# EAGLE design transition_control_arduino (EAGLE 9.2.2)
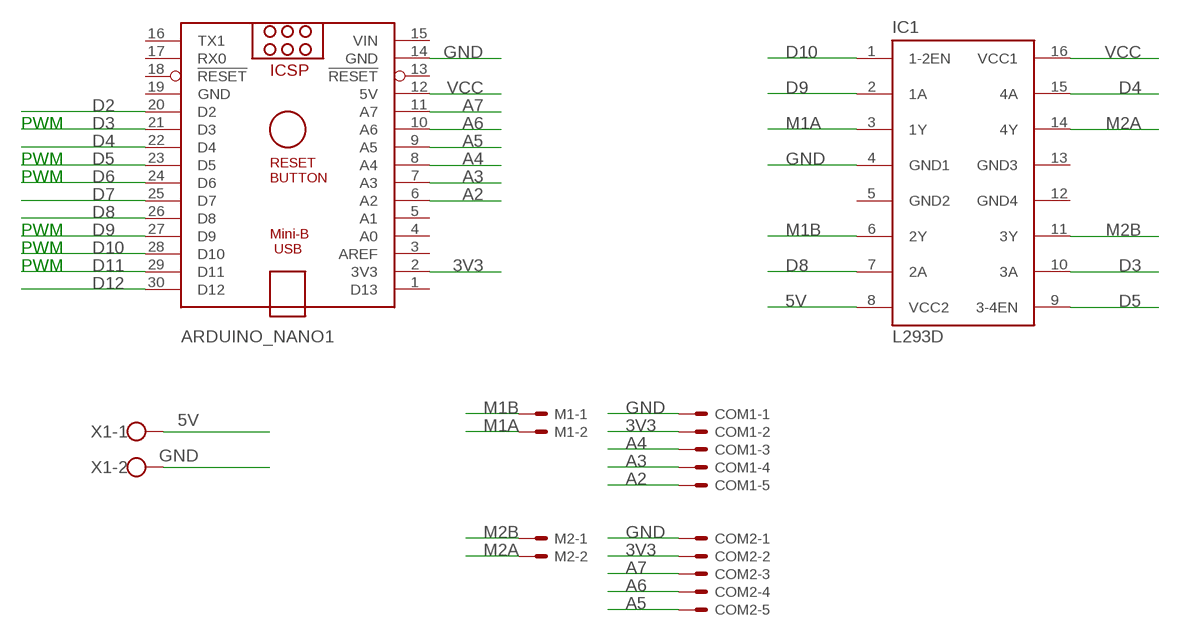
[diagram p0: schematic, sheet 1]

## Parts
ARDUINO_NANO1  ARDUINO_NANO  [ARDUINO_NANO]
COM1  JST-XH-05-PIN-ROUND-PAD  [JST-XH-05-PACKAGE-ROUND-PAD]
COM2  JST-XH-05-PIN-ROUND-PAD  [JST-XH-05-PACKAGE-ROUND-PAD]
IC1  L293D  [DIL16]
M1  JST-XH-02-PIN-ROUND-PAD  [JST-XH-02-PACKAGE-ROUND-PAD]
M2  JST-XH-02-PIN-ROUND-PAD  [JST-XH-02-PACKAGE-ROUND-PAD]
X1  W237-102  [W237-102]

## Nets
3V3 [Thicc]: ARDUINO_NANO1.2(3V3) COM1.2 COM2.2
5V [Thicc]: IC1.8(VCC2) X1.1
A2 [Thicc]: ARDUINO_NANO1.6(A2) COM1.5
A3 [Thicc]: ARDUINO_NANO1.7(A3) COM1.4
A4 [Thicc]: ARDUINO_NANO1.8(A4) COM1.3
A5 [Thicc]: ARDUINO_NANO1.9(A5) COM2.5
A6 [Thicc]: ARDUINO_NANO1.10(A6) COM2.4
A7 [Thicc]: ARDUINO_NANO1.11(A7) COM2.3
D2 [Thicc]: ARDUINO_NANO1.20(D2)
D3 [Thicc]: ARDUINO_NANO1.21(D3) IC1.10(3A)
D4 [Thicc]: ARDUINO_NANO1.22(D4) IC1.15(4A)
D5 [Thicc]: ARDUINO_NANO1.23(D5) IC1.9(3-4EN)
D6 [Thicc]: ARDUINO_NANO1.24(D6)
D7 [Thicc]: ARDUINO_NANO1.25(D7)
D8 [Thicc]: ARDUINO_NANO1.26(D8) IC1.7(2A)
D9 [Thicc]: ARDUINO_NANO1.27(D9) IC1.2(1A)
D10 [Thicc]: ARDUINO_NANO1.28(D10) IC1.1(1-2EN)
D11 [Thicc]: ARDUINO_NANO1.29(D11)
D12 [Thicc]: ARDUINO_NANO1.30(D12)
GND [Thicc]: ARDUINO_NANO1.14(GND) COM1.1 COM2.1 IC1.4(GND1) X1.2
M1A [Thicc]: IC1.3(1Y) M1.2
M1B [Thicc]: IC1.6(2Y) M1.1
M2A [Thicc]: IC1.14(4Y) M2.2
M2B [Thicc]: IC1.11(3Y) M2.1
VCC [Thicc]: ARDUINO_NANO1.12(5V) IC1.16(VCC1)
Unconnected: ARDUINO_NANO1.1(D13) ARDUINO_NANO1.3(AREF) ARDUINO_NANO1.4(A0) ARDUINO_NANO1.5(A1) ARDUINO_NANO1.13(!RESET) ARDUINO_NANO1.16(TX1) ARDUINO_NANO1.17(RX0) ARDUINO_NANO1.18(!RESET)

## Notes on the sheet
- PWM
- PWM
- PWM
- PWM
- PWM
- PWM

## Power pins joined to a net without a drawn wire
GND: ARDUINO_NANO1.19(GND)
GND2: IC1.5(GND2)
GND3: IC1.13(GND3)
GND4: IC1.12(GND4)
VIN: ARDUINO_NANO1.15(VIN)

## Library data of the parts
ARDUINO_NANO1 = ArduinoNanoV30:ARDUINO_NANO: Arduino Nano V3.0 Overview: The Arduino Nano is a small, complete, and breadboard-friendly board based on the ATmega328 (Arduino Nano 3.x) or ATmega168 (Arduino Nano 2.x). It has more or less the same functionality of the Arduino Duemilanove, but in a different package. It lacks only a DC power jack, and works with a Mini-B USB cable instead of a standard one. The Nano was designed and is being produced by Gravitech. Specifications: Microcontroller Atmel ATmega168 or ATmega328 Operating Voltage (logic level) 5 V Input Voltage (recommended) 7-12 V Input Voltage (limits) 6-20 V Digital I/O Pins 14 (of which 6 provide PWM output) Analog Input Pins 8 DC Current per I/O Pin 40 mA Flash Memory 16 KB (ATmega168) or 32 KB (ATmega328) of which 2 KB used by bootloader SRAM 1 KB (ATmega168) or 2 KB (ATmega328) EEPROM 512 bytes (ATmega168) or 1 KB (ATmega328) Clock Speed 16 MHz Dimensions 0.73" x 1.70" Length 45 mm Width 18 mm Weigth 5 g Power: The Arduino Nano can be powered via the Mini-B USB connection, 6-20V unregulated external power supply (pin 30), or 5V regulated external power supply (pin 27). The power source is automatically selected to the highest voltage source. Memory: The ATmega168 has 16 KB of flash memory for storing code (of which 2 KB is used for the bootloader); the ATmega328 has 32 KB, (also with 2 KB used for the bootloader). The ATmega168 has 1 KB of SRAM and 512 bytes of EEPROM (which can be read and written with the EEPROM library); the ATmega328 has 2 KB of SRAM and 1 KB of EEPROM. Input and Output: Each of the 14 digital pins on the Nano can be used as an input or output, using pinMode(), digitalWrite(), and digitalRead() functions. They operate at 5 volts. Each pin can provide or receive a maximum of 40 mA and has an internal pull-up resistor (disconnected by default) of 20-50 kOhms. In addition, some pins have specialized functions. Visit Arduino - ArduinoBoardNano <https://www.arduino.cc/en/Main/ArduinoBoardNano>
COM1 COM2 = Rembrandt Electronics - JST XH Connectors v1-0:JST-XH-05-PIN: JST XH Connector 2 Pin Wire to board connector. Pitch: 2,54 mm, (0.100") Number of pins: 5 Created by Rembrandt Electronics www.rembrandtelectronics.com
IC1 = st-microelectronics:L293D: PUSH-PULL 4 CHANNEL DRIVER; MPN: L293D; OC_FARNELL: 9589619; OC_NEWARK: 56P8249
M1 M2 = Rembrandt Electronics - JST XH Connectors v1-0:JST-XH-02-PIN: JST XH Connector 2 Pin Wire to board connector. Pitch: 2,54 mm, (0.100") Number of pins: 2 Created by Rembrandt Electronics www.rembrandtelectronics.com
X1 = con-wago-500:W237-102: WAGO SCREW CLAMP; MPN: 237-102; OC_FARNELL: unknown; OC_NEWARK: 70K9898

## Net classes
1 Thicc: width 0.813 mm

## Board
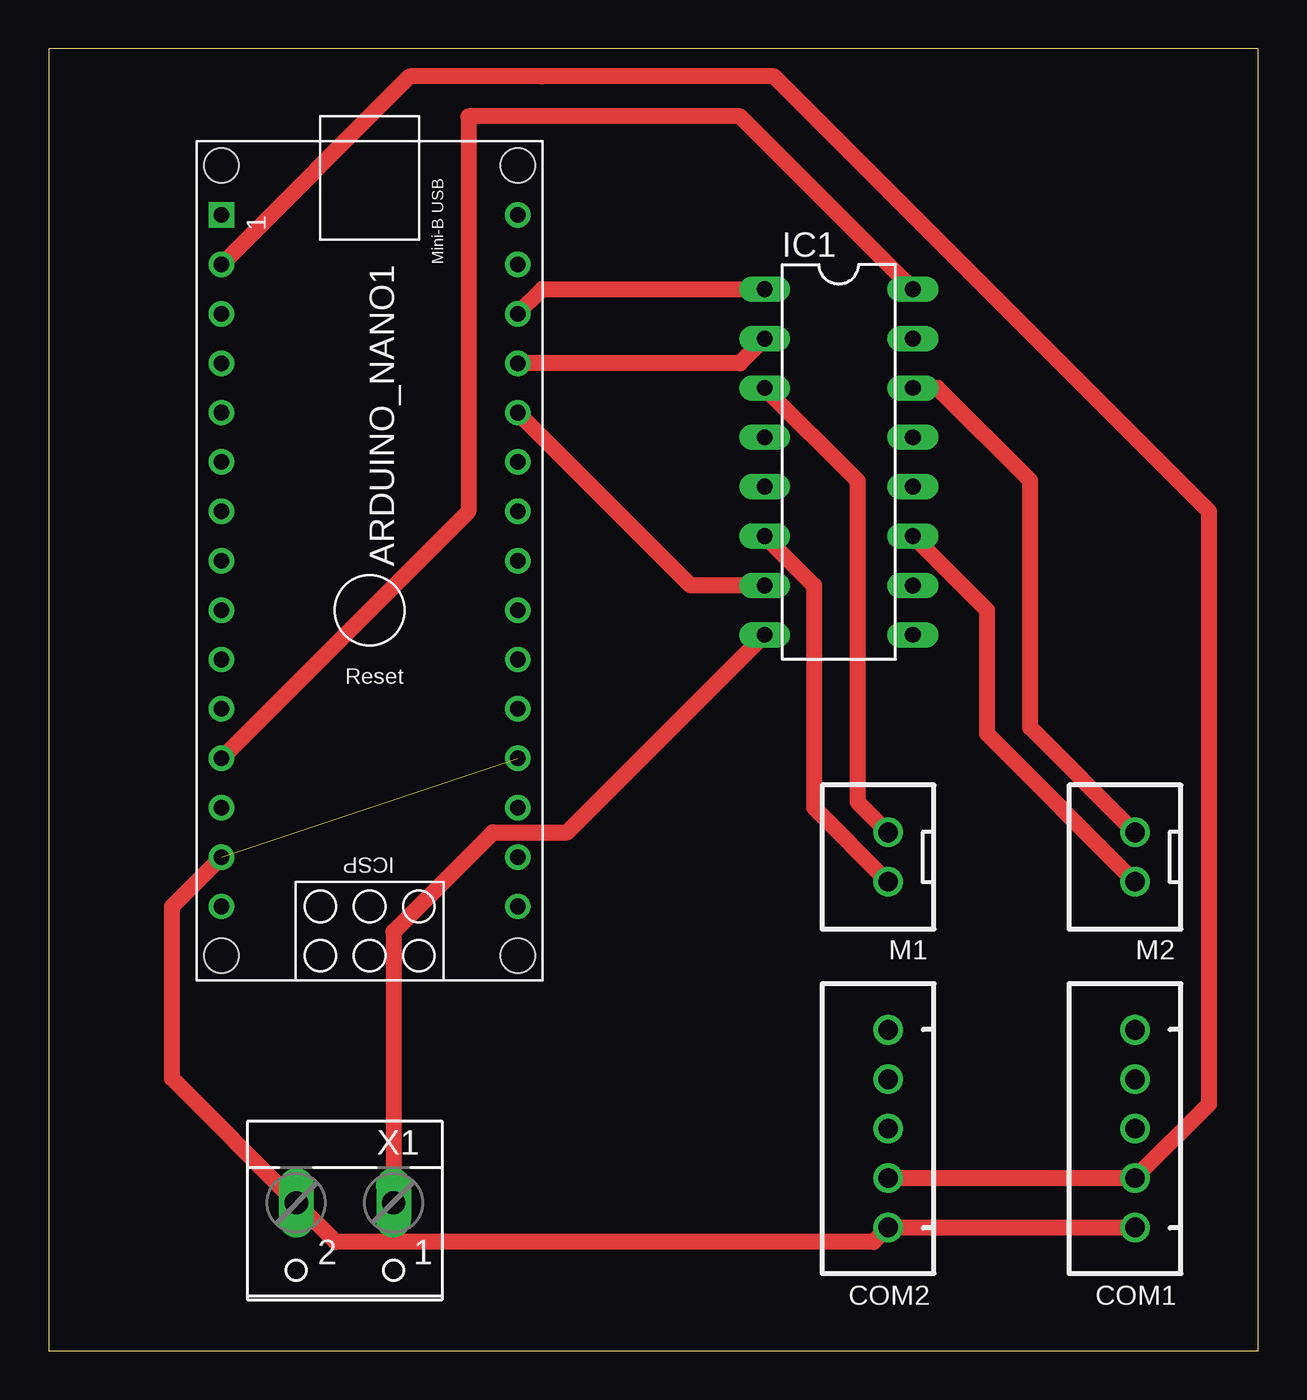
[diagram p1: board, top side]
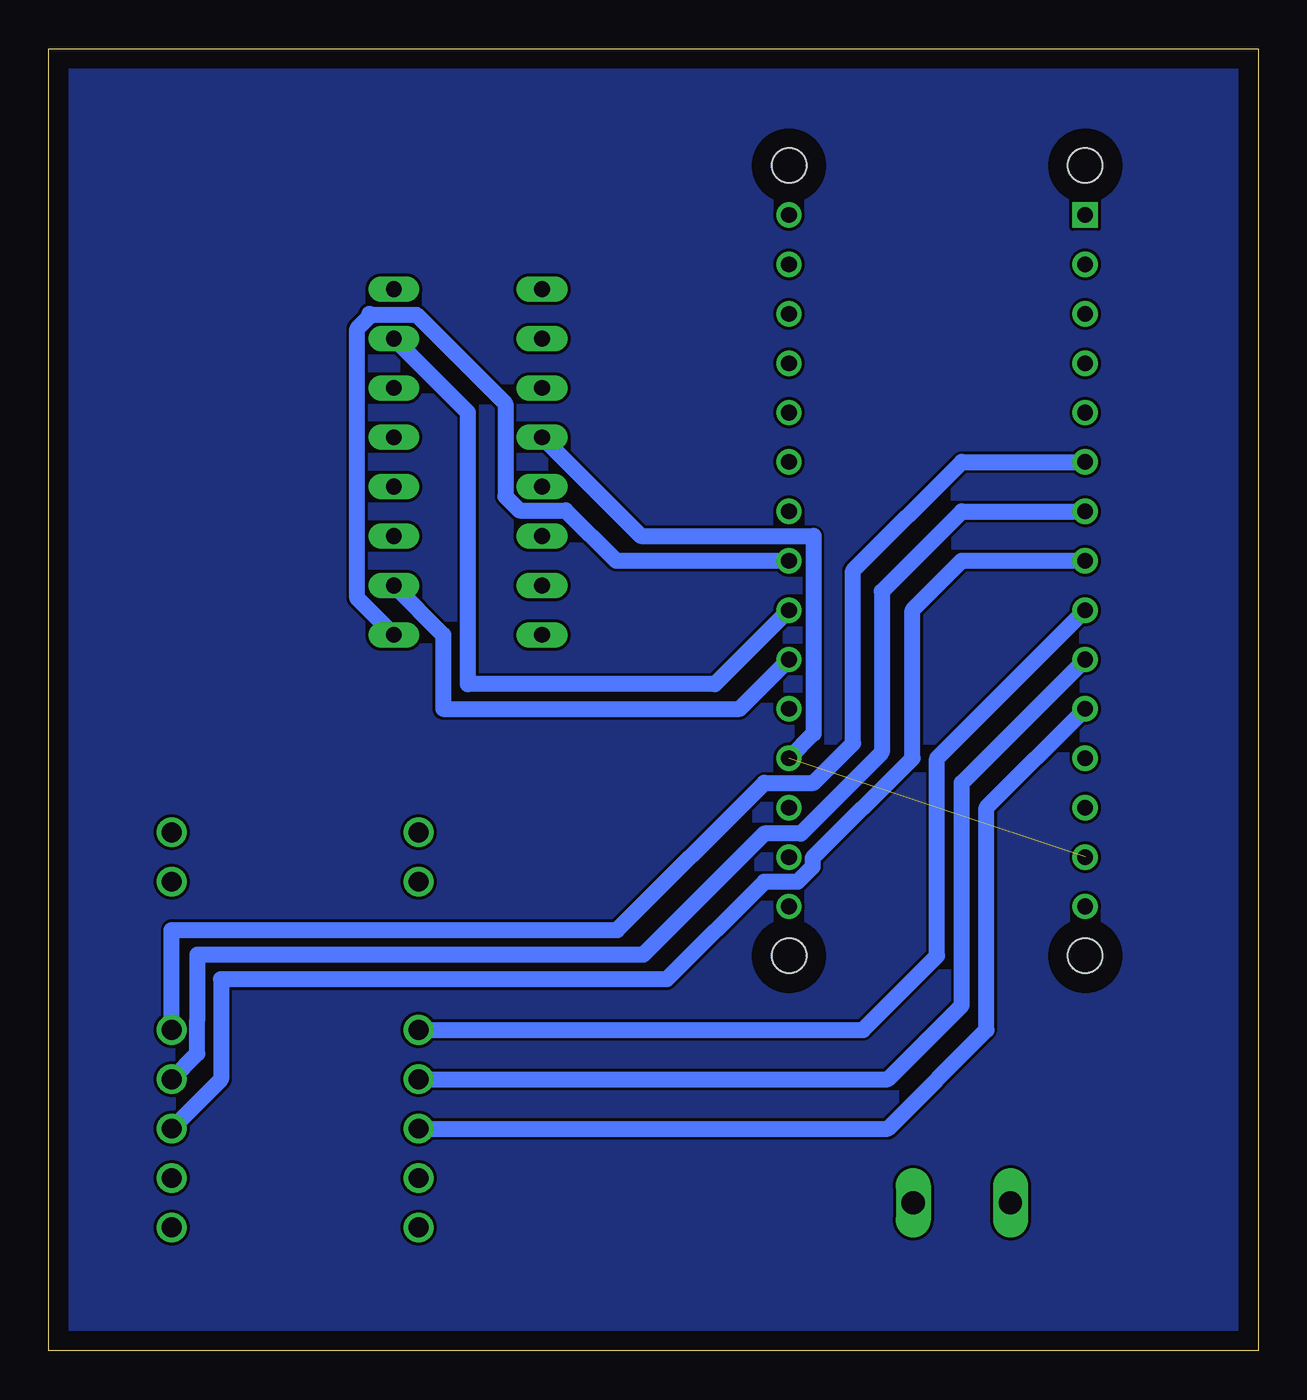
[diagram p2: board, bottom side, seen from below]

Size 62.21 x 66.98 mm. Coordinates in mm from the lower left corner, seen from the top.
Outline: 0,0 62.21,0 62.21,66.98 0,66.98 0,0
Copper layers (1*16): Top 0.035mm / dielectric 1.5mm / Bottom 0.035mm
Design rules "default": minimum track width 6mil, minimum drill 0.35mm, track to track 6mil, track to pad 6mil, pad to pad 6mil, via to via 6mil, smd to smd 6mil, copper to edge 40mil, drill to drill 6mil, minimum pad ring 10mil, minimum via ring 8mil, stop-mask expansion 4mil, vias tented up to drill 0mil, thermal gap 10mil

### Footprints (pad centres in the part's own frame; a part is rotated, then mirrored left to right if it is on the bottom)
ARDUINO_NANO = drill 0.8 square: 1 -20.32,-7.62 | drill 0.8: 2 -17.78,-7.62; 3 -15.24,-7.62; 4 -12.7,-7.62; 5 -10.16,-7.62; 6 -7.62,-7.62; 7 -5.08,-7.62; 8 -2.54,-7.62; 9 0,-7.62; 10 2.54,-7.62; 11 5.08,-7.62; 12 7.62,-7.62; 13 10.16,-7.62; 14 12.7,-7.62; 15 15.24,-7.62; 16 15.24,7.62; 17 12.7,7.62; 18 10.16,7.62; 19 7.62,7.62; 20 5.08,7.62; 21 2.54,7.62; 22 0,7.62; 23 -2.54,7.62; 24 -5.08,7.62; 25 -7.62,7.62; 26 -10.16,7.62; 27 -12.7,7.62; 28 -15.24,7.62; 29 -17.78,7.62; 30 -20.32,7.62 | hole 1.778: -22.86,-7.62; -22.86,7.62; 17.78,7.62; 17.78,-7.62
JST-XH-05-PACKAGE-ROUND-PAD = drill 1.016: 1 -5.08,0; 2 -2.54,0; 3 0,0; 4 2.54,0; 5 5.08,0
DIL16 = drill 0.813 long: 1 -8.89,-3.81; 2 -6.35,-3.81; 3 -3.81,-3.81; 4 -1.27,-3.81; 5 1.27,-3.81; 6 3.81,-3.81; 7 6.35,-3.81; 8 8.89,-3.81; 9 8.89,3.81; 10 6.35,3.81; 11 3.81,3.81; 12 1.27,3.81; 13 -1.27,3.81; 14 -3.81,3.81; 15 -6.35,3.81; 16 -8.89,3.81
JST-XH-02-PACKAGE-ROUND-PAD = drill 1.016: 1 -1.27,0; 2 1.27,0
W237-102 = drill 1.194 long: 1 -2.5,-1.27; 2 2.5,-1.27

### Placement (x,y rotation side)
ARDUINO_NANO1  16.51,38.1 270 top
COM1  55.88,11.43 90 top
COM2  43.18,11.43 90 top
IC1  40.64,45.72 270 top
M1  43.18,25.4 90 top
M2  55.88,25.4 90 top
X1  15.24,6.35 180 top

### Tracks (layer width: path | path; a pad name or v marks a point on that pad's centre or on a via)
3V3
  Top 0.813: COM2.2 COM1.2 59.69,12.7 59.69,43.18 37.31,65.56 25.4,65.56 25.34,65.56 18.57,65.56 ARDUINO_NANO1.2
5V
  Top 0.813: X1.1 17.74,21.55 22.86,26.67 26.67,26.67 IC1.8
A2
  Bottom 0.813: COM1.5 55.88,21.65 32.96,21.65 25.4,29.21 22.86,29.21 20.83,31.24 20.83,40.13 15.24,45.72 ARDUINO_NANO1.6
A3
  Bottom 0.813: COM1.4 54.56,15.29 54.56,17.06 54.56,20.38 31.63,20.38 25.39,26.61 23.52,26.61 19.35,30.78 19.35,39.06 15.24,43.18 ARDUINO_NANO1.7
A4
  Bottom 0.813: COM1.3 53.34,13.97 53.34,19.11 30.42,19.11 25.4,24.13 23.68,24.13 22.92,24.9 22.92,25.34 17.78,30.48 17.78,38.1 15.24,40.64 ARDUINO_NANO1.8
A5
  Bottom 0.813: COM2.5 20.32,16.51 16.51,20.32 16.51,30.48 ARDUINO_NANO1.9
A6
  Bottom 0.813: COM2.4 19.05,13.97 15.24,17.78 15.24,29.21 ARDUINO_NANO1.10
A7
  Bottom 0.813: COM2.3 19.05,11.43 13.97,16.51 13.97,27.94 ARDUINO_NANO1.11
D3
  Bottom 0.813: 45.1,39.37 IC1.10 41.91,36.83 41.91,33.02 26.67,33.02 ARDUINO_NANO1.21
D4
  Bottom 0.813: ARDUINO_NANO1.22 27.94,34.29 40.64,34.29 40.64,48.26 IC1.15
D5
  Bottom 0.813: IC1.9 46.33,38.71 46.33,52.58 45.72,53.19 45.72,53.34 45.67,53.29 43.28,53.29 38.71,48.71 38.71,43.94 37.99,43.23 35.61,43.23 33.02,40.64 ARDUINO_NANO1.23
D8
  Top 0.813: IC1.7 33.02,39.37 ARDUINO_NANO1.26
D9
  Top 0.813: IC1.2 35.56,50.8 ARDUINO_NANO1.27
D10
  Top 0.813: ARDUINO_NANO1.28 25.4,54.61 IC1.1
GND  (1 unrouted)
  Top 0.813: ARDUINO_NANO1.14 6.35,22.86 6.35,14.01 X1.2 14.76,5.6 42.43,5.6 COM2.1 COM1.1
  Bottom 0.813: IC1.4 31.75,41.91 22.86,41.91 22.86,31.75 ARDUINO_NANO1.19
M1A
  Top 0.813: M1.2 41.61,28.24 41.61,44.75 IC1.3
M1B
  Top 0.813: M1.1 39.37,27.94 39.37,39.37 IC1.6
M2A
  Top 0.813: IC1.14 45.72,49.53 50.49,44.75 50.49,32.05 M2.2
M2B
  Top 0.813: M2.1 48.26,31.75 48.26,38.1 IC1.11
N$1
  pour Bottom: 0,67.31 62.23,67.31 62.23,0 0,0
VCC
  Top 0.813: IC1.16 35.56,63.5 21.59,63.5 21.59,43.18 ARDUINO_NANO1.12